# EAGLE design LibreServo-v2 (EAGLE 7.6.0)
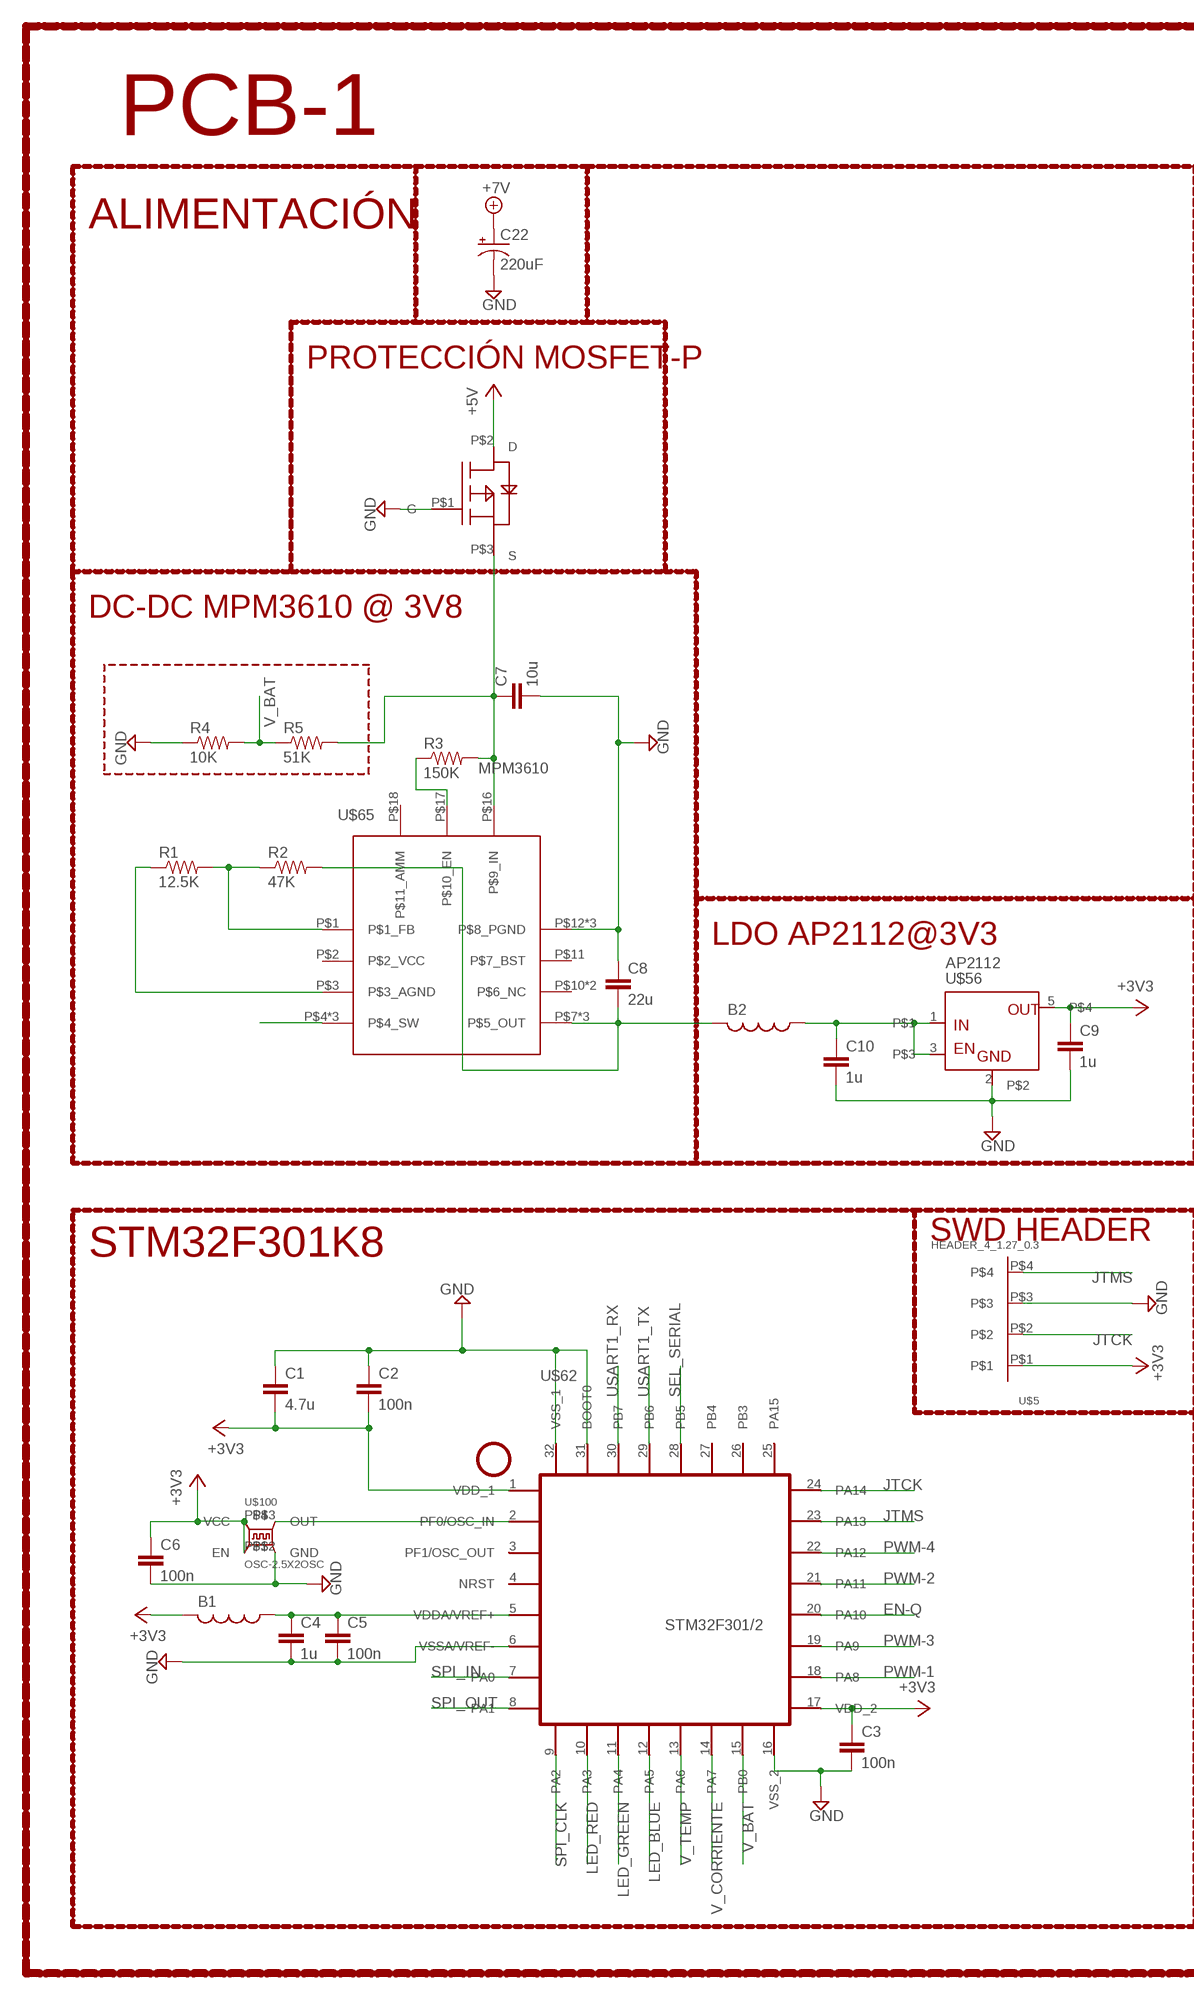
[diagram p0: schematic, sheet 1, part 1 of 2]
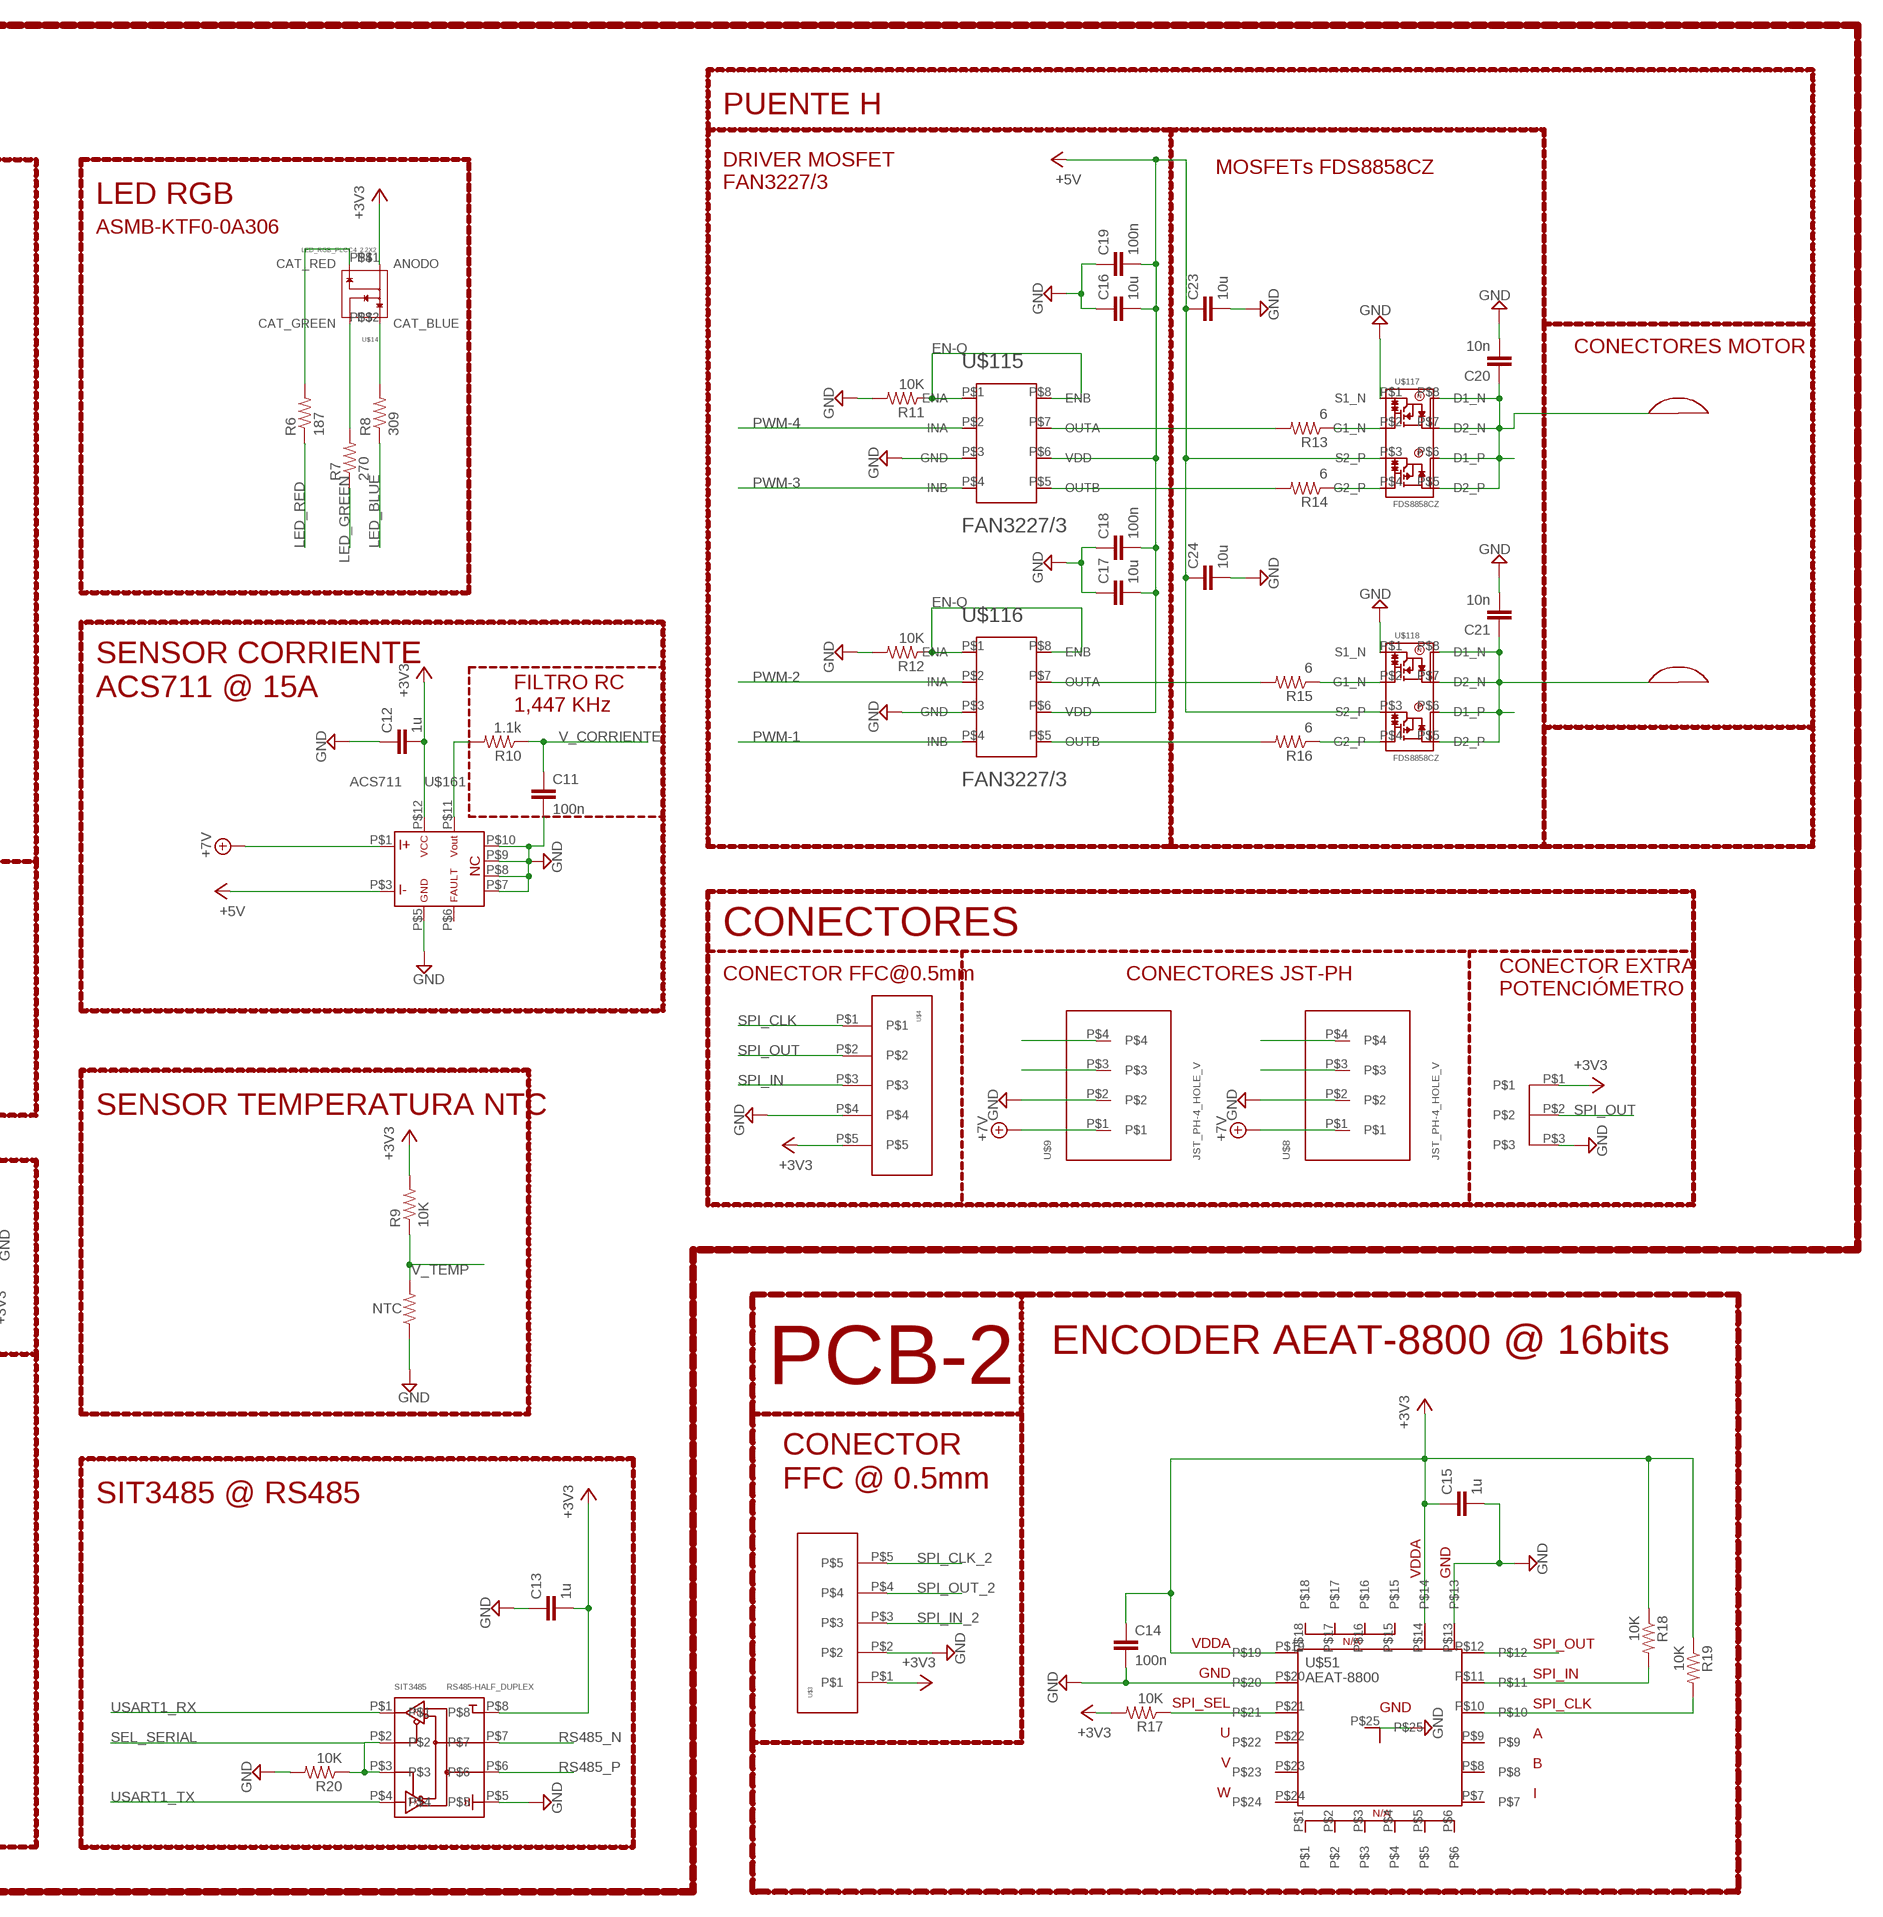
[diagram p1: schematic, sheet 1, part 2 of 2]

## Parts
B1  FERRITE_BEAD_0402  [0402]
B2  FERRITE_BEAD_0603  [0603]
C1  4.7u  C-EU0402  [0402]
C2  100n  C-EU0402  [0402]
C3  100n  C-EU0402  [0402]
C4  1u  C-EU0402  [0402]
C5  100n  C-EU0402  [0402]
C6  100n  C-EU0402  [0402]
C7  10u  C-EU0603  [0603]
C8  22u  C-EU1206  [1206]
C9  1u  C-EU0402  [0402]
C10  1u  C-EU0402  [0402]
C11  100n  C-EU0402  [0402]
C12  1u  C-EU0402  [0402]
C13  1u  C-EU0402  [0402]
C14  100n  C-EU0402  [0402]
C15  1u  C-EU0402  [0402]
C16  10u  C-EU0603  [0603]
C17  10u  C-EU0603  [0603]
C18  100n  C-EU0402  [0402]
C19  100n  C-EU0402  [0402]
C20  10n  C-EU0402  [0402]
C21  10n  C-EU0402  [0402]
C22  220uF  CPOL-USE2.5-6  [E2,5-6]
C23  10u  C-EU0603  [0603]
C24  10u  C-EU0603  [0603]
M1  M1  P5103EMA  [SOT23]
NTC  R-US0402_MIN  [0402_MIN]
R1  12.5K  R-US0402  [0402]
R2  47K  R-US0402  [0402]
R3  150K  R-US0402  [0402]
R4  10K  R-US0402  [0402]
R5  51K  R-US0402  [0402]
R6  187  R-US0402  [0402]
R7  270  R-US0402  [0402]
R8  309  R-US0402  [0402]
R9  10K  R-US0402  [0402]
R10  1.1k  R-US0402  [0402]
R11  10K  R-US0402  [0402]
R12  10K  R-US0402  [0402]
R13  6  R-US0402  [0402]
R14  6  R-US0402  [0402]
R15  6  R-US0402  [0402]
R16  6  R-US0402  [0402]
R17  10K  R-US0402  [0402]
R18  10K  R-US0402  [0402]
R19  10K  R-US0402  [0402]
R20  10K  R-US0402  [0402]
SIT3485  RS485-HALF_DUPLEX  [MSOP-8]
U$1  SLOT  [SERVO_SLOT]
U$2  SLOT  [SERVO_SLOT]
U$3  FFC-5  [FFC-5-0.5]
U$4  FFC-5  [FFC-5-0.5]
U$5  HEADER_4_1.27_0.3  [HEADER_4_1.27_0.3]
U$6  POTEN_SERVO  [POTEN_SERVO]
U$8  JST_PH-4_HOLE_V  [JST_PH-4_HOLEV]
U$9  JST_PH-4_HOLE_V  [JST_PH-4_HOLEV]
U$14  LED_RGB_PLCC4_2.2X2  [PLCC-4_2.2X2]
U$51  AEAT-8800  [QFN24]
U$56  AP2112  [SOT25]
U$62  STM32F301/2  STM32F302  [QFN32]
U$65  MPM3610  MPM36XX  [MPM36XX]
U$100  OSC-2.5X2OSC  [OSC-2.5X2]
U$115  FAN3227/3  [MLP8]
U$116  FAN3227/3  [MLP8]
U$117  FDS8858CZ  [SO-8]
U$118  FDS8858CZ  [SO-8]
U$161  ACS711  [ACS711-QFN]

## Nets
+3V3: B1.2 C1.2 C2.2 C3.1 C6.1 C9.1 C12.2 C13.2 R9.2 SIT3485.P$8 U$4.P$5 U$5.P$1 U$6.P$1 U$14.P$1(ANODO) U$56.5 U$62.1(VDD_1) U$62.17(VDD_2) U$100.P$1(EN) U$100.P$4(VCC) U$161.P$12
+3V3_2: C14.1 C15.1 R17.2 R18.1 R19.1 U$3.P$1 U$51.P$14 U$51.P$19 ; supply symbol labelled +3V3
+5V: C16.2 C17.2 C18.2 C19.2 C23.1 C24.1 M1.P$2(D) U$115.P$6(VDD) U$116.P$6(VDD) U$117.P$3(S2_P) U$118.P$3(S2_P) U$161.P$3
+7V: C22.+ U$8.P$1 U$9.P$1 U$161.P$1
EN-Q: R11.1 R12.1 U$62.20(PA10) U$115.P$1(ENA) U$115.P$8(ENB) U$116.P$1(ENA) U$116.P$8(ENB)
GND: C1.1 C2.1 C3.2 C4.2 C5.2 C6.2 C7.2 C8.1 C9.2 C10.2 C11.2 C12.1 C13.1 C16.1 C17.1 C18.1 C19.1 C20.2 C21.2 C22.- C23.2 C24.2 M1.P$1(G) NTC.1 R4.1 R11.2 R12.2 R20.2 SIT3485.P$5 U$4.P$4 U$5.P$3 U$6.P$3 U$8.P$2 U$9.P$2 U$56.2 U$62.6(VSSA/VREF-) U$62.16(VSS_2) U$62.31(BOOT0) U$62.32(VSS_1) U$65.P$12(P$8_PGND) U$65.P$13(P$8_PGND) U$65.P$14(P$8_PGND) U$100.P$2(GND) U$115.P$3(GND) U$116.P$3(GND) U$117.P$1(S1_N) U$118.P$1(S1_N) U$161.P$5 U$161.P$7 U$161.P$8 U$161.P$9 U$161.P$10
GND_2: C14.2 C15.2 U$3.P$2 U$51.P$13 U$51.P$20 U$51.P$25 ; supply symbol labelled GND
IN_AP2112: B2.1 C10.1 U$56.1 U$56.3
JTCK: U$5.P$2 U$62.24(PA14)
JTMS: U$5.P$4 U$62.23(PA13)
LED_BLUE: R8.1 U$62.12(PA5)
LED_GREEN: R7.1 U$62.11(PA4)
LED_RED: R6.1 U$62.10(PA3)
N$1: R6.2 U$14.P$4(CAT_RED)
N$2: R10.2 U$161.P$11
N$3: U$65.P$4(P$4_SW) U$65.P$5(P$4_SW) U$65.P$6(P$4_SW)
N$4: R7.2 U$14.P$3(CAT_GREEN)
N$5: R8.2 U$14.P$2(CAT_BLUE)
N$8: R13.1 U$117.P$2(G1_N)
N$9: R13.2 U$115.P$7(OUTA)
N$10: R14.2 U$115.P$5(OUTB)
N$11: R14.1 U$117.P$4(G2_P)
N$12: R15.1 U$118.P$2(G1_N)
N$15: R15.2 U$116.P$7(OUTA)
N$17: R17.1 U$51.P$21
N$18: R16.1 U$118.P$4(G2_P)
N$19: R16.2 U$116.P$5(OUTB)
N$23: C7.1 M1.P$3(S) R3.2 R5.2 U$65.P$16(P$9_IN)
N$24: R1.2 R2.1 U$65.P$1(P$1_FB)
N$28: C20.1 U$1.P$1 U$117.P$5(D2_P) U$117.P$6(D1_P) U$117.P$7(D2_N) U$117.P$8(D1_N)
N$32: C21.1 U$2.P$1 U$118.P$5(D2_P) U$118.P$6(D1_P) U$118.P$7(D2_N) U$118.P$8(D1_N)
N$38: R1.1 U$65.P$3(P$3_AGND)
N$42: U$62.2(PF0/OSC_IN) U$100.P$3(OUT)
N$52: B1.1 C4.1 C5.1 U$62.5(VDDA/VREF+)
N$77: R3.1 U$65.P$17(P$10_EN)
OUT_MPM3610: B2.2 C8.2 R2.2 U$65.P$7(P$5_OUT) U$65.P$8(P$5_OUT) U$65.P$9(P$5_OUT)
PWM-1: U$62.18(PA8) U$116.P$4(INB)
PWM-2: U$62.21(PA11) U$116.P$2(INA)
PWM-3: U$62.19(PA9) U$115.P$4(INB)
PWM-4: U$62.22(PA12) U$115.P$2(INA)
RS485_N [Diff]: SIT3485.P$7 U$8.P$3 U$9.P$3
RS485_P [Diff]: SIT3485.P$6 U$8.P$4 U$9.P$4
SEL_SERIAL: R20.1 SIT3485.P$2 SIT3485.P$3 U$62.28(PB5)
SPI_CLK: U$4.P$1 U$62.9(PA2)
SPI_CLK_2: R19.2 U$3.P$5 U$51.P$10
SPI_IN: U$4.P$3 U$62.7(PA0)
SPI_IN_2: R18.2 U$3.P$3 U$51.P$11
SPI_OUT: U$4.P$2 U$6.P$2 U$62.8(PA1)
SPI_OUT_2: U$3.P$4 U$51.P$12
USART1_RX: SIT3485.P$1 U$62.30(PB7)
USART1_TX: SIT3485.P$4 U$62.29(PB6)
V_BAT: R4.2 R5.1 U$62.15(PB0)
V_CORRIENTE: C11.1 R10.1 U$62.14(PA7)
V_TEMP: NTC.2 R9.1 U$62.13(PA6)
Unconnected: U$1.P$2 U$2.P$2 U$51.P$1 U$51.P$2 U$51.P$3 U$51.P$4 U$51.P$5 U$51.P$6 U$51.P$7 U$51.P$8 U$51.P$9 U$51.P$15 U$51.P$16 U$51.P$17 U$51.P$18 U$51.P$22 U$51.P$23 U$51.P$24 U$62.3(PF1/OSC_OUT) U$62.4(NRST) U$62.25(PA15) U$62.26(PB3) U$62.27(PB4) U$65.P$2(P$2_VCC) U$65.P$10(P$6_NC) U$65.P$11(P$7_BST) U$65.P$15(P$6_NC) U$65.P$18(P$11_AMM) U$161.P$6

## Notes on the sheet
- PUENTE H
- PCB-1
- MOSFETs FDS8858CZ
- DRIVER MOSFET
  FAN3227/3
- LED RGB
- ALIMENTACIÓN
- ASMB-KTF0-0A306
- PROTECCIÓN MOSFET-P | CONECTORES MOTOR
- DC-DC MPM3610 @ 3V8
- SENSOR CORRIENTE
  ACS711 @ 15A
- FILTRO RC
  1,447 KHz
- LDO AP2112@3V3
- CONECTORES
- CONECTOR FFC@0.5mm | CONECTORES JST-PH
- CONECTOR EXTRA
  POTENCIÓMETRO
- SENSOR TEMPERATURA NTC
- SWD HEADER
- STM32F301K8
- ENCODER AEAT-8800 @ 16bits
- PCB-2
- CONECTOR
  FFC @ 0.5mm
- SIT3485 @ RS485

## Library data of the parts
B1 = Propio:FERRITE_BEAD_0402
B2 = Propio:FERRITE_BEAD_0603
C1-C21 C23 C24 = Propio:C-EU
C22 = rcl:CPOL-US: POLARIZED CAPACITOR, American symbol
M1 = Propio:P5103EMA
NTC R1-R20 = Propio:R-US
SIT3485 = Propio:RS485-HALF_DUPLEX
U$1 U$2 = Propio:SLOT
U$3 U$4 = Propio:FFC-5
U$5 = Propio:HEADER_4
U$6 = Propio:POTEN_SERVO
U$8 U$9 = Propio:JST_PH-4_HOLE
U$14 = Propio:LED_RGB_PLCC4_2.2X2
U$51 = Propio:AEAT-8800
U$56 = Propio:AP2112
U$62 = Propio:STM32F302
U$65 = Propio:MPM36XX
U$100 = Propio:OSC-2.5X2
U$115 U$116 = Propio:FAN3227/3
U$117 U$118 = Propio:FDS8858CZ
U$161 = Propio:ACS711

## Net classes
1 Diff: width 0.178 mm, clearance 0.152 mm

## Board
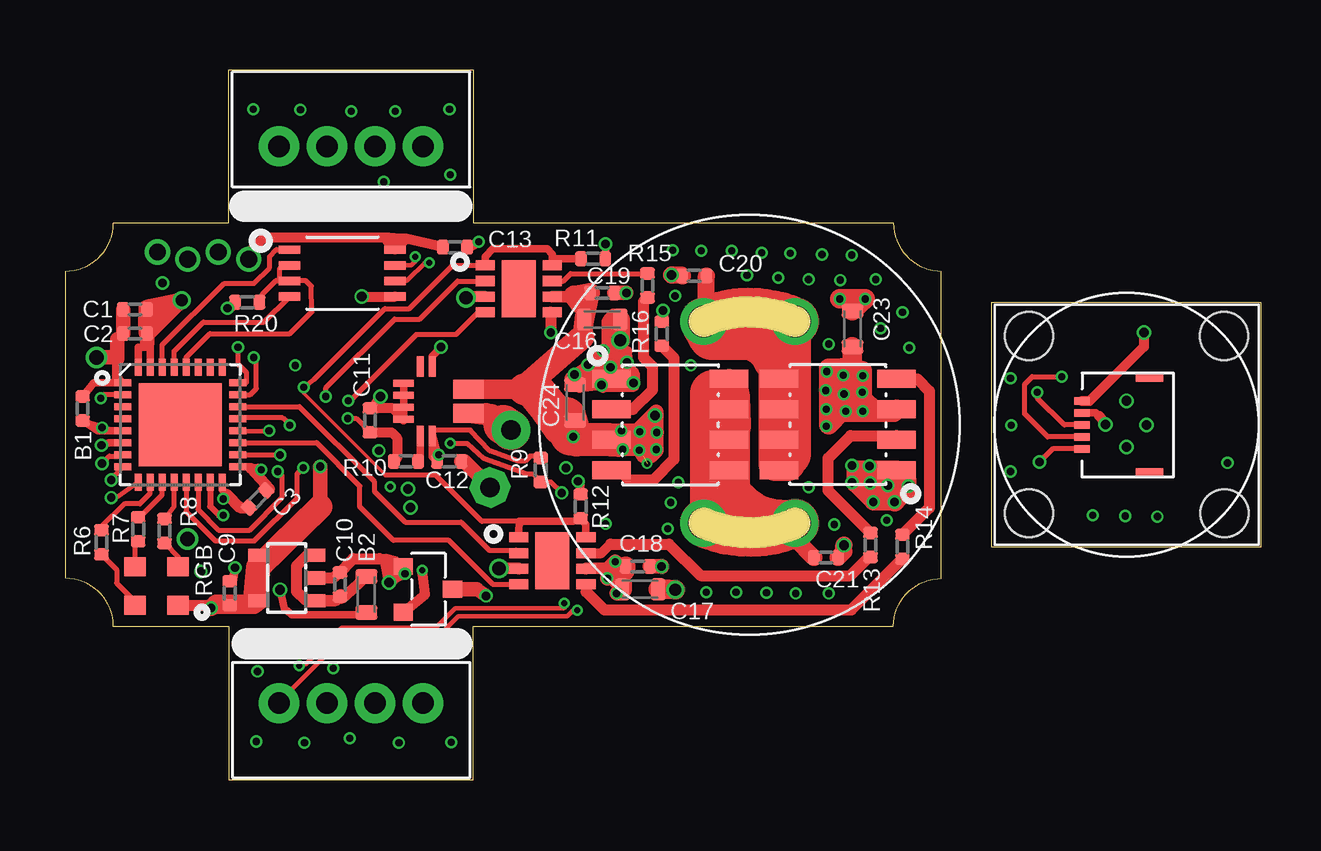
[diagram p2: board, top side]
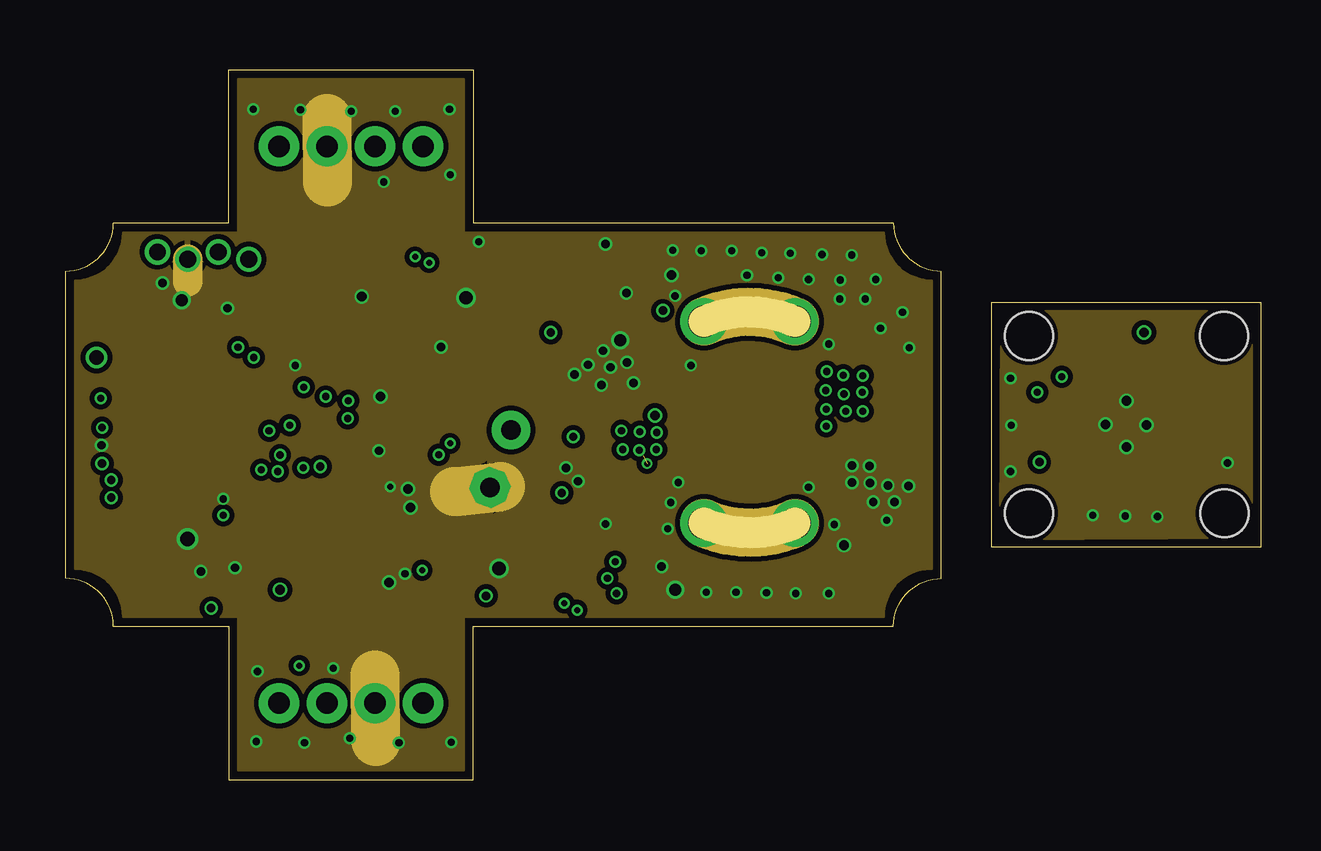
[diagram p3: board, inner layer Route2]
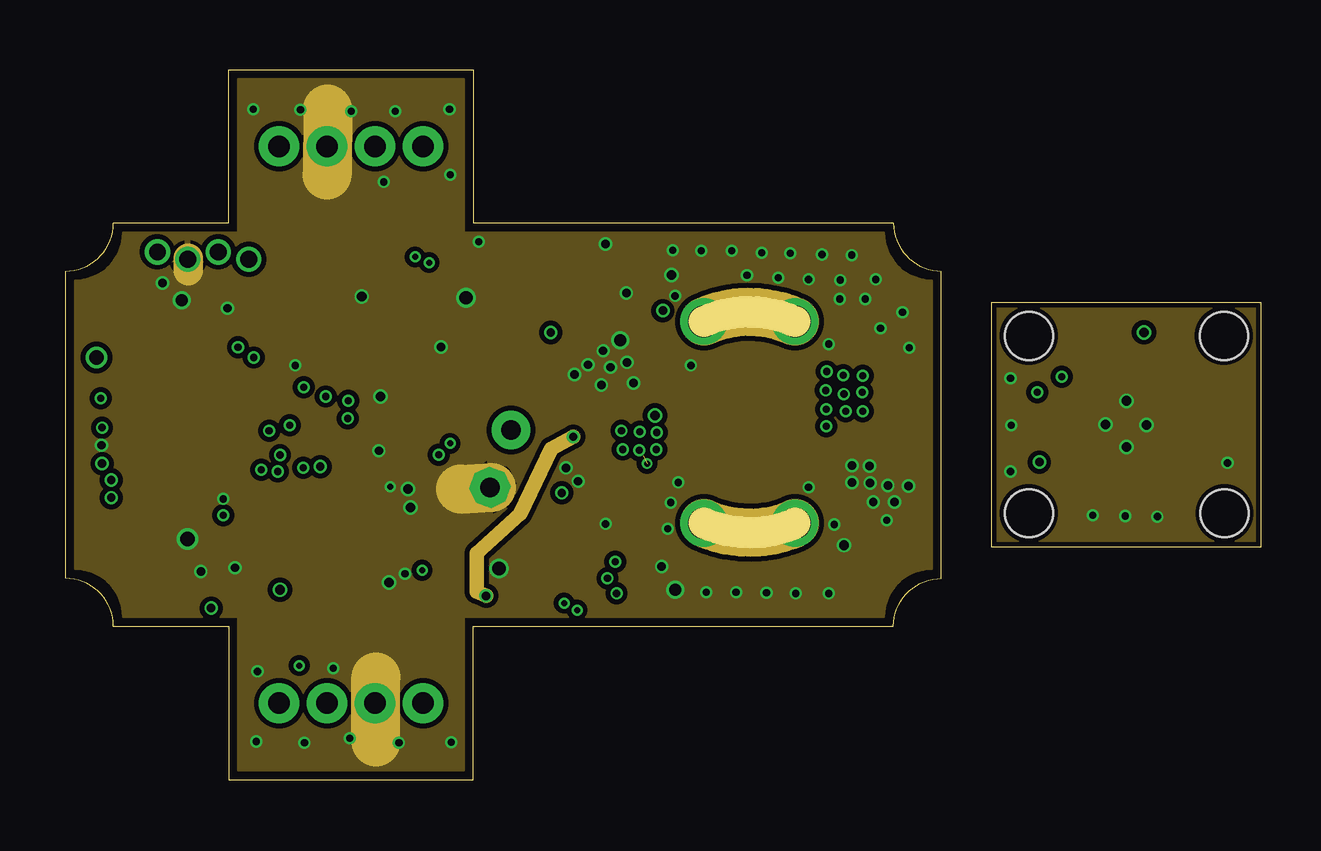
[diagram p4: board, inner layer Route15]
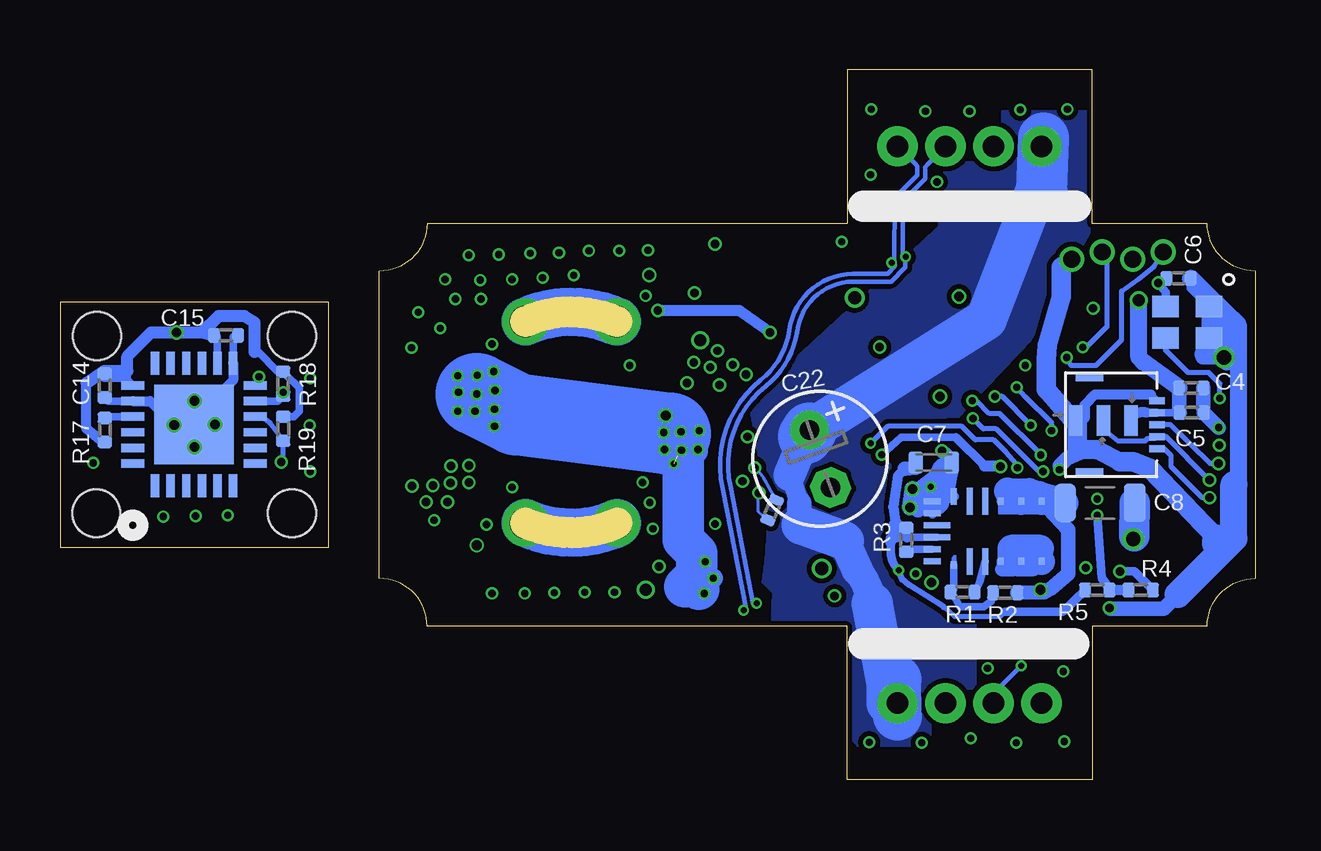
[diagram p5: board, bottom side, seen from below]

Size 49.8 x 29.6 mm. Coordinates in mm from the lower left corner, seen from the top.
Outline: 2,6.4 6.8,6.4 6.8,0 17,0 17,6.4 34.5,6.4 arc-90 36.5,8.4 36.5,21.2 arc-90 34.5,23.2 17,23.2 17,29.6 6.8,29.6 6.8,23.2 2,23.2 arc-90 0,21.2 0,8.4 arc-90 2,6.4
Outline: 38.6,19.9 49.8,19.9 49.8,9.7 38.6,9.7 38.6,19.9
Copper layers (1*2*15*16): Top 0.035559375mm / dielectric 0.17018125mm / Route2 0.01778125mm / dielectric 47mil / Route15 0.01778125mm / dielectric 0.17018125mm / Bottom 0.035559375mm
Design rules "jlcpcb_4_layer *": minimum track width 5mil, minimum drill 0.25mm, track to track 0.126490625mm, track to pad 0.126490625mm, pad to pad 0.126490625mm, via to via 0.126490625mm, smd to smd 0mil, copper to edge 0.1mm, drill to drill 5mil, minimum pad ring 4mil, minimum via ring 4mil, stop-mask expansion 3mil, vias tented up to drill 100mil, thermal gap 10mil
Holes 2 mm at 40.14,11.11 40.14,18.5 48.27,18.5 48.29,11.11

### Footprints (pad centres in the part's own frame; a part is rotated, then mirrored left to right if it is on the bottom)
0402 = smd 0.5 x 0.6: 1 -0.5,0; 2 0.5,0
0603 = smd 0.6 x 0.9: 1 -0.75,0; 2 0.75,0
1206 = smd 0.9 x 1.6: 1 -1.45,0; 2 1.45,0
E2,5-6 = drill 0.813 pad 1.6: + -1.27,0 | drill 0.813 pad 1.6 octagon: - 1.27,0
SOT23 = smd 0.7 x 0.8: P$1 -0.95,-1.25; P$2 0,0.8; P$3 0.95,-1.25
0402_MIN = smd 0.4 x 0.6: 1 -0.45,0; 2 0.45,0
MSOP-8 = smd 0.9 x 0.35: P$1 -2.2,0.975; P$2 -2.2,0.325; P$3 -2.2,-0.325; P$4 -2.2,-0.975; P$5 2.2,-0.975; P$6 2.2,-0.325; P$7 2.2,0.325; P$8 2.2,0.975
SERVO_SLOT = drill 1.3: P$1 -1.9,4.2; P$2 1.9,4.2
FFC-5-0.5 = smd 0.3 x 0.65: P$1 -1,0; P$2 -0.5,0; P$3 0,0; P$4 0.5,0; P$5 1,0 | smd 0.3 x 1.15: P$6 -1.96,2.81; P$7 1.96,2.81
HEADER_4_1.27_0.3 = drill 0.7 pad 1.016: P$1 -2.54,0; P$2 -1.27,0.3; P$3 0,0; P$4 1.27,0.3
POTEN_SERVO = smd 0.55 x 1.27: P$1 -1.15,0; P$2 0,0; P$3 1.15,0
JST_PH-4_HOLEV = drill 0.9 pad 1.676: P$1 -3,0; P$2 -1,0; P$3 1,0; P$4 3,0
PLCC-4_2.2X2 = smd 0.9 x 0.8: P$1 -0.9,0.8; P$2 -0.9,-0.8; P$3 0.9,-0.8; P$4 0.9,0.8
QFN24 = smd 0.95 x 0.35: P$1 -2.55,1.625; P$2 -2.55,0.975; P$3 -2.55,0.325; P$4 -2.55,-0.325; P$5 -2.55,-0.975; P$6 -2.55,-1.625; P$13 2.55,-1.625; P$14 2.55,-0.975; P$15 2.55,-0.325; P$16 2.55,0.325; P$17 2.55,0.975; P$18 2.55,1.625 | smd 0.35 x 0.95: P$7 -1.625,-2.55; P$8 -0.975,-2.55; P$9 -0.325,-2.55; P$10 0.325,-2.55; P$11 0.975,-2.55; P$12 1.625,-2.55; P$19 1.625,2.55; P$20 0.975,2.55; P$21 0.325,2.55; P$22 -0.325,2.55; P$23 -0.975,2.55; P$24 -1.625,2.55 | smd 3.3 x 3.3: P$25 0,0
SOT25 = smd 0.55 x 0.8: 1 -0.95,-1.2; 2 0,-1.2; 3 0.95,-1.2; 4 0.95,1.2; 5 -0.95,1.2
QFN32 = smd 0.3 x 0.7: 1 -1.75,-2.4; 2 -1.25,-2.4; 3 -0.75,-2.4; 4 -0.25,-2.4; 5 0.25,-2.4; 6 0.75,-2.4; 7 1.25,-2.4; 8 1.75,-2.4; 17 1.75,2.4; 18 1.25,2.4; 19 0.75,2.4; 20 0.25,2.4; 21 -0.25,2.4; 22 -0.75,2.4; 23 -1.25,2.4; 24 -1.75,2.4 | smd 0.7 x 0.3: 9 2.4,-1.75; 10 2.4,-1.25; 11 2.4,-0.75; 12 2.4,-0.25; 13 2.4,0.25; 14 2.4,0.75; 15 2.4,1.25; 16 2.4,1.75; 25 -2.4,1.75; 26 -2.4,1.25; 27 -2.4,0.75; 28 -2.4,0.25; 29 -2.4,-0.25; 30 -2.4,-0.75; 31 -2.4,-1.25; 32 -2.4,-1.75 | smd 3.45 x 3.45: EP 0,0
MPM36XX = smd 0.3 x 0.25: P$1 -1.4,1.55; P$4 -1.25,-0.4; P$5 -1.25,-1.25; P$6 -1.25,-2.1; P$7 1.25,-2.1; P$8 1.25,-1.25; P$9 1.25,-0.4 | smd 1.1 x 0.25: P$2 -1.25,0.9; P$3 -1.25,0.25 | smd 1.125 x 0.25: P$10 1.25,0.25; P$11 1.25,0.9 | smd 0.7 x 0.25: P$12 1.45,1.55 | smd 0.25 x 0.7: P$13 1.25,2.45; P$14 0.75,2.45; P$17 -0.75,2.45; P$18 -1.25,2.45 | smd 0.25 x 1.1: P$15 0.25,2.25; P$16 -0.25,2.25
OSC-2.5X2 = smd 0.9 x 1.1: P$1 -0.65,0.9; P$2 -0.65,-0.9; P$3 0.65,-0.9; P$4 0.65,0.9
MLP8 = smd 0.8 x 0.42: P$1 -1.4,0.975; P$2 -1.4,0.325; P$3 -1.4,-0.325; P$4 -1.4,-0.975; P$5 1.4,-0.975; P$6 1.4,-0.325; P$7 1.4,0.325; P$8 1.4,0.975 | smd 1.42 x 2.37: P$9 0,0
SO-8 = smd 1.6 x 0.75: P$1 -2.45,1.905; P$2 -2.45,0.635; P$3 -2.45,-0.635; P$4 -2.45,-1.905; P$5 2.45,-1.905; P$6 2.45,-0.635; P$7 2.45,0.635; P$8 2.45,1.905
ACS711-QFN = smd 1.27 x 0.8: P$1 0,0.5; P$3 0,-0.5 | smd 0.3 x 0.85: P$5 1.5,-1.45; P$6 2,-1.45; P$11 2,1.45; P$12 1.5,1.45 | smd 0.85 x 0.3: P$7 2.7,-0.75; P$8 2.7,-0.25; P$9 2.7,0.25; P$10 2.7,0.75

### Placement (x,y rotation side)
B1  0.71,15.47 90 top
B2  12.54,7.73 270 top
C1  2.9,19.6 180 top
C2  2.9,18.6 180 top
C3  8,11.7 225 top
C4  2.67,16.33 180 bottom
C5  2.64,15.31 180 bottom
C6  3.2,20.9 180 bottom
C7  13.39,13.22 0 bottom
C8  6.47,11.54 180 bottom
C9  6.84,7.77 90 top
C10  11.44,8.14 90 top
C11  12.69,14.98 90 top
C12  15.99,13.27 180 top
C13  16.23,22.2 180 top
C14  47.93,16.44 270 bottom
C15  42.88,18.52 0 bottom
C16  22.37,19.18 180 top
C17  23.94,7.94 180 top
C18  23.84,8.9 180 top
C19  22.36,20.29 180 top
C20  26.2,21 180 top
C21  31.69,9.26 0 top
C22  18.13,13.38 290 bottom
C23  32.79,18.8 90 top
C24  21.23,15.72 90 top
M1  15.32,7.94 270 top
NTC  20.13,11.24 247 bottom
R1  12.19,7.83 180 bottom
R2  10.42,7.8 0 bottom
R3  14.54,10 90 bottom
R4  4.77,7.91 180 bottom
R5  6.59,7.91 180 bottom
R6  1.5,9.9 270 top
R7  3.03,10.45 270 top
R8  4.13,10.37 270 top
R9  19.8,12.91 90 top
R10  14.19,13.27 0 top
R11  21.98,21.72 0 top
R12  21.47,11.4 90 top
R13  33.54,9.79 270 top
R14  34.87,9.71 270 top
R15  24.25,20.6 90 top
R16  24.84,18.59 90 top
R17  47.93,14.58 270 bottom
R18  40.51,16.51 270 bottom
R19  40.5,14.63 270 bottom
R20  7.58,19.9 180 top
SIT3485  11.54,21.12 0 top
U$1  28.5,14.9 0 top
U$2  28.5,14.9 180 top
U$3  42.36,14.79 270 top
U$4  4.1,14.8 90 bottom
U$5  5.1,21.7 0 bottom
U$6  6.32,14.99 0 bottom
U$8  11.9,3.2 180 top
U$9  11.9,26.4 0 top
U$14  3.79,8.08 180 top
U$51  44.21,14.81 90 bottom
U$56  9.22,8.42 90 top
U$62  4.78,14.8 270 top
U$65  11,10.36 90 bottom
U$100  2.83,19.07 270 bottom
U$115  20.29,9.13 0 top
U$116  18.89,20.46 0 top
U$117  32.18,14.8 180 top
U$118  25.2,14.8 0 top
U$161  16.79,15.77 180 top

### Tracks (layer width: path | path; a pad name or v marks a point on that pad's centre or on a via)
+3V3  (via drill 0.3, 0.35, 0.6)
  Top 0.203: R9.2 19.73,13.49 19.36,13.49 19.15,13.28 18.87,13.28 17.68,13.71 16.87,14.58 15.29,14.58 v15.55,13.55
  Top 0.254: U$62.17 8.03,13.05 v8.15,12.93
  Top 0.305: B1.2 1.19,16.55 U$62.1 2.16,16.77 | C12.2 15.29,13.48 | 15.29,13.48 U$161.P$12 | U$62.17 7.68,13.05 7.72,12.98 | 15.29,13.48 15.54,13.48 v15.55,13.55
  Top 0.406: 2.16,16.69 2.16,16.77 2.16,17.55 2.13,17.6 | 2.16,18.36 C2.2 | C13.2 14.2,22.55 SIT3485.P$8 13.31,22.59 14.17,22.55 13.46,22.6 8.28,22.6 7.64,21.96 U$5.P$1
  Top 0.457: 7.72,12.98 8.51,12.12 C3.1 | U$14.P$1 5.95,7.28 arc-90 v6.07,7.16 | U$56.5 7.9,7.54
  Top 0.61: C1.2 C2.2 | 2.16,17.55 2.16,18.36 | v1.29,17.6 2.13,17.6 | 10.62,11.38 v10.62,13.05 | 7.85,7.31 C9.1
  Top 0.66: 6.27,7.31 v6.07,7.16
  Top 0.813: U$56.5 7.85,7.31 6.27,7.31
  Top 1.016: 10.62,11.38 8.03,8.86 7.9,7.54
  Bottom 0.305: C6.1 2.7,20.49 U$100.P$1 | 8.18,12.95 v8.15,12.93 | 10.64,13.08 v10.62,13.05 | v15.55,13.55 14.76,14.27 12.47,14.27 | U$4.P$5 4.35,16.05
  Bottom 0.356: 11.28,13.08 12.47,14.27
  Bottom 0.406: 4.35,16.05 6.68,16.05 7.11,15.62 7.11,15.05 U$6.P$1
  Bottom 0.457: v8.15,12.93 8.15,13.08 | 11.28,13.08 10.64,13.08
  Bottom 0.559: 7.41,14.77 U$6.P$1 | 7.16,13.69 7.41,13.78
  Bottom 0.61: 2.13,17.73 v1.29,17.6 2.18,17.6 | U$100.P$1 U$100.P$4 | v6.07,7.16 6.04,7.14 3.81,7.14 3.23,7.72 | 1.22,17.37 1.17,17.42 | 8.15,13.08 7.82,13.41 7.16,13.69
  Bottom 0.66: 1.71,9.84 1.1,9.84
  Bottom 0.711: 0.89,12.32 0.69,12.52 0.69,18.92 0.71,18.97 | 1.17,17.42 1.32,17.58 1.32,19.56 0.71,18.97 | 0.71,18.97 2.66,20.9 C6.1
  Bottom 0.762: 5.64,13.26 6.58,13.77
  Bottom 0.813: U$100.P$4 2.13,17.73 | 1.69,10.15 4.39,12.98 5.08,13.26 5.64,13.26 | 6.58,13.77 7.41,13.78 7.41,14.77 8.71,16.28 8.71,17.5 8.66,18.11 8.08,20.14 8.08,21.36 U$5.P$1
  Bottom 1.016: 1.71,9.84 1.69,10.15
  Bottom 1.118: 3.23,7.72 1.1,9.84 0.89,10.06 0.89,12.32
+3V3_2  (via drill 0.4)
  Top 0.406: U$3.P$1 42.67,15.79 44.93,18.05 44.94,18.05 v44.94,18.65
  Bottom 0.203: 40.38,16.88 40.38,16.89 R18.1 40.53,17.04 40.74,17.04
  Bottom 0.305: U$51.P$14 43.24,18.48 C15.1 | 40.38,16.88 39.83,16.33 39.83,15.37 40.07,15.13 R19.1 | 47.26,16.94 U$51.P$19 47,16.67 47,17.04 | R17.2 48.02,14.08 | 47.97,17.04 C14.1 | 40.74,17.04 41.53,17.83 41.69,17.83
  Bottom 0.406: 48.02,14.08 48.7,14.63 48.7,16.54
  Bottom 0.508: 48.7,16.54 47.97,17.04 | 47,17.04 47,17.65 46,18.65 v44.94,18.65 43.87,18.65 | 43.87,18.65 C15.1 | 41.69,17.83 41.69,19.05 42.12,19.33 43.19,19.33 43.87,18.65
  Bottom 0.711: C14.1 47.26,16.94
+5V  (via drill 0.25, 0.3, 0.35, 0.4)  (1 unrouted)
  Top 0.457: 31.8,14.81 31.77,14.81 v31.7,14.73 | v31.7,15.44 31.83,15.31 32.31,15.31 32.46,15.31 v32.51,15.37 | 33.5,15.6 33.45,15.6 v33.22,15.37 | 32.51,16.61 32.51,16.89 v32.41,16.87 | v31.73,17.02 31.8,16.94 | 31.8,16.79 31.8,16.36 v31.67,16.23 | v33.22,16.84 33.22,16.87 33.2,16.99
  Top 0.483: U$115.P$6 21.7,8.81 22.61,8.81 22.63,8.79 | U$116.P$6 21.03,20.14 21.03,20.17
  Top 0.508: v23.22,13.77 23.22,13.79
  Top 0.559: 17.13,7.94 v17.53,7.67 | 20.68,14.76 20.76,14.79 | 20.76,14.79 C24.1 | 20.85,15.09 20.76,14.79
  Top 0.61: 22.63,8.79 22.68,8.69 | 21.03,20.17 21.16,20.29 C19.2 | U$118.P$3 22.71,14.55 v23.16,14.55 23.82,14.55 | 23.82,14.55 24.61,15.34 24.61,15.21 | 24.61,15.21 v24.61,13.77 24.61,13.71 24.41,13.51 24.08,13.51 23.93,13.79 23.85,13.79 | 23.01,13.79 23.04,13.77 22.78,13.79 23.01,13.79 | 23.85,13.79 23.22,13.79 23.01,13.79 | 23.85,13.79 24.08,14.02 24.08,14.27 24.21,14.4 | 24.21,14.4 23.82,14.4 23.65,14.22 | 23.82,14.55 23.88,14.55 v23.93,14.5 | 23.85,13.79 v23.9,13.74 | 24.21,14.4 24.56,14.4 v24.64,14.48 | v24.56,15.19 24.59,15.19 24.61,15.21 | v22.96,7.77 23.02,7.77 C17.2 | v22.58,8.41 v22.59,8.41 22.77,8.59 | 22.61,8.81 22.63,8.81 v22.91,9.09 | M1.P$2 17.13,7.94 | v21.16,14.3 21.41,14.48 20.85,15.09
  Top 0.813: C17.2 23.19,8.15 22.77,8.59 22.68,8.69 23.31,8.69 C18.2 | C19.2 21.41,19.84 21.16,20.17 21.84,20.29 C16.2 21.54,18.46 | U$117.P$3 34.51,15.31 32.31,15.31 31.8,14.81 31.8,16.79 31.8,16.94 31.8,17.14 32.79,17.2 | 32.79,17.2 33.2,17.04 33.2,16.99 v33.2,16.15 33.2,15.9 33.5,15.6 32.66,15.6 32.46,15.8 v32.44,16.08 32.46,16.56 32.51,16.61 | U$161.P$3 19.11,16.27 19.09,16.34 | 32.79,17.2 C23.1
  Top 1.016: 19.09,16.34 21.54,18.46 | 21.29,14.16 21.06,14.38
  Top 1.321: 19.11,16.27 19.66,16.1
  Top 1.372: U$118.P$3 21.29,14.16
  Top 1.626: 19.66,16.1 20.22,15.42
  Top 1.651: 20.22,15.42 20.68,14.76
  Top 1.727: 21.06,14.38 20.85,15.09
  Route15 0.61: v17.53,7.67 17.14,7.85 17.14,9.45 18.95,11.09 20.24,13.79 v21.16,14.3
  Bottom 0.305: 23.16,9.37 23.16,9.35 v22.91,9.09
  Bottom 0.813: C17.2 23.05,7.94 v22.58,8.41
  Bottom 1.016: v24.64,14.48 23.34,14.48 23.32,14.5 23.32,13.69 24.54,13.69 24.59,13.74 24.59,15.21 24.64,15.27 24.11,15.27 23.34,14.5 24.51,14.5 24.4,14.43
  Bottom 1.727: C17.2 23.3,8.05 23.77,8.05 23.27,8.56 23.27,9.45 23.82,10.01 23.82,13.66 v23.9,13.74
  Bottom 3.429: 24.4,14.43 30.78,15.24 v32.44,16.08
  other vias: 24.23,13.18
+7V
  Top 0.813: 17.53,15.3 U$161.P$1 17.75,15.15
  Top 1.016: 18.24,14.81 17.75,15.15
  Top 1.651: C22.+ 18.24,14.81
  Bottom 0.813: 19,11.53 19.2,12.19 19.41,12.7
  Bottom 1.016: 18.92,10.62 19,10.54 19,11.53
  Bottom 1.219: 15.95,7.34 arc-28 16.59,8.76
  Bottom 1.321: 16.59,8.76 17.12,9.96 | 19.41,12.7 18.75,14.3
  Bottom 1.626: 17.12,9.96 18.92,10.62
  Bottom 1.727: U$9.P$1 8.71,26.4 8.71,25.65 11.2,19.2 C22.+ | U$8.P$1 15.34,3.2 15.34,3.94 15.95,7.34
  Bottom 2.032: 14.91,2.67 14.94,4.19
  Bottom 2.134: 8.89,24.54 8.81,26.74
  Bottom 2.286: 18.75,14.3 C22.+
  pour Bottom (isolate 0.203): 6.99,27.86 10.54,27.86 10.54,25.73 13.16,25.73 13.16,23.06 21.08,15.79 20.24,11.07 20.4,9.17 20.52,8.23 20.09,7.8 20.12,6.78 20.14,6.53 16.99,6.48 16.94,6.43 16.94,1.8 16.56,1.42 13.94,1.42 13.54,1.83 13.54,3.45 13.18,3.81 11.66,3.81 11.66,6.55 12.9,6.6 15.37,9.17 15.01,12.5 15.39,13.66 15.49,15.01 12.34,15.14 9.42,18.26 6.91,22.81
EN-Q  (via drill 0.3)
  Top 0.152: 13.34,12.7 9.8,16.23 v9.93,16.36
  Top 0.203: U$62.20 7.2,14.53 v8.48,14.55 | v9.93,16.36 10.36,16.69 13.31,19.63 14.33,19.63 16.13,21.44 U$116.P$1 | 18.9,10.77 17.35,10.77 15.42,12.7 13.34,12.7
  Top 0.305: U$115.P$8 21.69,10.65 21.34,10.99 R12.1 21.16,10.77 18.9,10.77 18.89,10.32 U$115.P$1 | U$116.P$1 17.48,21.8 17.8,22.12 20.07,22.12 20.29,21.9 U$116.P$8 arc-90 20.57,21.72 R11.1
  Bottom 0.203: v8.48,14.55 8.48,14.88 9.55,15.95 v9.93,16.36
GND  (via drill 0.25, 0.3, 0.35, 0.4, 0.5, 0.55, 0.6)
  Top 0.203: 6.53,12.09 7.32,11.48 v6.58,11.71
  Top 0.305: U$62.31 3.53,18.11 | 3.53,18.11 3.4,18.19 | U$62.32 3.03,18.03 3.05,18.03 3.45,18.03 3.53,18.11 | 12.94,15.48 C11.2 | U$161.P$10 U$161.P$9 U$161.P$8 U$161.P$7 | U$62.16 6.53,12.09 6.73,11.89 | U$62.6 1.83,14.05 v1.5,13.94 | U$161.P$5 15.29,17.65 v15.65,18.03 | R11.2 22.5,21.74 v22.5,22.33 | M1.P$1 13.46,8.18 v14.15,8.58 | R12.2 21.47,12.35 v21.36,12.45
  Top 0.356: C9.2 7,8.35 v7.06,8.84
  Top 0.406: C13.1 16.92,22.25 v17.22,22.43 | 12.94,15.48 12.94,15.71 v13.13,15.98 | U$161.P$10 13.63,15.48 C11.2 | v6.75,19.65 6.88,19.69 R20.2 | v12.34,20.14 v12.35,20.14 SIT3485.P$5 | 21.03,16.43 21.23,16.43 C24.2
  Top 0.457: U$56.2 11.15,8.42 11.37,8.59 C10.2 11.74,8.98 11.99,9.22 13.09,9.22 13.29,9.19 | 6.73,11.89 7.27,11.35 C3.2 | U$116.P$3 16.79,20.14 v16.69,20.09 | 13.46,8.36 13.79,9.07 13.29,9.19 | 13.29,9.19 v13.49,8.23 | U$118.P$1 22.4,16.36 v22.33,16.46 21.41,16.36 21.03,16.43 21.03,16.74 21.92,16.79 21.06,16.79 21.69,17.22 23.42,17.22 23.7,16.94 23.7,16.43 23.65,16.38 22.55,16.38 21.87,17.07 21.87,17.4 22,17.52 23.42,17.35 23.39,17.65 23.39,17.86 23.27,17.73 22.17,17.73 22.38,17.93 22.73,17.93 22.58,18.08 22.58,19.15 22.63,19.2 22.81,19.41 23.11,18.9 v23.11,18.31
  Top 0.483: U$115.P$3 18.88,8.81 v18.06,8.81
  Top 0.61: 3.4,18.19 C2.1 | C18.1 v24.84,8.9 v24.84,8.89 | C19.1 v23.37,20.29 | C12.1 16.61,13.28 C22.-
  Top 0.66: C2.1 4.81,20.01 v4.85,19.99 3.5,19.71 3.81,19.58 3.38,18.64 3.35,18.92 3.37,19.66 C1.1
  Top 0.711: C20.2 25.67,21.03 v25.25,21.03 | C21.2 32.44,9.51 v32.44,9.78
  Top 0.813: C17.1 25.12,7.94 v25.4,7.92 | C16.1 v23.11,18.31 | U$117.P$1 32.96,12.89 32.94,12.88 32.94,12.37 33.68,11.63 34.59,11.63 | 34.59,11.63 35.05,12.09 35.05,12.5 35,12.55 34.75,12.29 33.68,12.29 | v34.54,11.58 34.59,11.63 | C23.2 v33.33,20.04 v32.26,20.04
  Route2 1.219: 5.09,20.75 U$5.P$3
  Route2 2.032: 10.92,24.92 10.9,27.56 | 12.93,1.6 12.9,4.37 | 16.2,12.01 18.14,12.22
  Route15 1.219: 5.11,21.74 5.11,21.21
  Route15 2.032: 10.92,27.97 10.9,25.2 | 12.93,1.57 12.93,4.29 | 16.46,12.12 17.75,12.19
  Bottom 0.127: NTC.1 20.37,12.39 arc-18 v20.85,13
  Bottom 0.203: 14.07,12.1 13.97,11.81
  Bottom 0.305: 12.93,12.88 12.93,13.64 v13.06,13.71 | C5.2 U$4.P$4
  Bottom 0.356: U$100.P$2 3.73,20.31 v4.04,20.7 4.04,20.77 C6.2 | R4.1 4.24,7.9 5.03,8.69 v5.64,8.69 | U$4.P$4 4.53,15.3
  Bottom 0.406: 13.31,11.61 U$65.P$12 | U$65.P$13 U$65.P$14 | 4.53,15.3 arc-90 U$6.P$3
  Bottom 0.508: C7.2 14.07,12.1
  Bottom 0.559: v13.06,13.71 12.65,13.33
  Bottom 0.61: C4.2 3.17,15.33 C5.2
  Bottom 0.66: 13.97,11.81 v14.28,12.12 | v14.38,11.35 14.28,12.09 14.05,11.28
  Bottom 0.711: C4.2 4.67,17.42 4.85,17.6 v4.85,19.99
  Bottom 0.914: 5.04,10.15 v5.08,10.03
  Bottom 1.118: U$65.P$13 13.31,11.61 13.06,12.17 12.93,12.88
  Bottom 1.27: C8.1 5.04,10.15
  other vias: 33.5,13.08 32.77,13.11 32.77,12.39 33.66,11.58 33.53,12.37 34.26,12.27 35.13,12.24 21.21,16.89 21.77,17.3 22.4,17.88 22.71,17.2 23.39,17.4 23.67,16.53 25.4,20.17 25.3,22.07 26.49,22.05 27.76,22.05 28.4,21.03 29.69,20.93 29.01,21.97 30.2,21.94 30.96,20.85 31.52,21.89 32.28,20.83 32.77,21.87 33.76,20.85 31.8,18.16 34.87,19.48 35.15,18.01 33.96,18.82 26.7,7.82 27.94,7.82 29.21,7.8 30.43,7.77 31.8,7.77 34.21,10.82 25.53,12.39 25.22,11.56 25.1,10.46 30.96,12.19 32.03,10.64 22.5,10.67 9.58,17.27 8,4.52 11.15,4.65 7.95,1.6 9.96,1.55 11.85,1.73 13.89,1.55 16.08,1.57 7.82,27.94 9.79,27.92 11.91,27.86 13.74,27.87 16,27.94 16.03,25.22 13.26,24.92 13.53,12.22 26.06,17.27
  pour Route2 (isolate 0.203): 0.4,20.8 0.4,8.8 arc-90 2.4,6.8 34.1,6.8 arc-90 36,8.8 36.1,8.8 36.1,20.8 arc-90 34.1,22.8 2.4,22.8 arc-90
  pour Route15 (isolate 0.203, rank 2): 0.4,20.8 0.4,8.8 arc-90 2.4,6.8 34.1,6.8 arc-90 36.1,8.8 36.1,20.8 arc-90 34.1,22.8 2.4,22.8 arc-90
  pour Route2 (isolate 0.203): 7.2,22.8 7.2,29.2 16.6,29.2 16.6,22.8
  pour Route15 (isolate 0.203): 7.2,22.8 7.2,29.2 16.6,29.2 16.6,22.8
  pour Route15 (isolate 0.203, rank 2): 7.2,6.8 7.2,0.4 16.6,0.4 16.6,6.8
  pour Route2 (isolate 0.203): 7.2,6.8 7.2,0.4 16.6,0.4 16.6,6.8
GND_2  (via drill 0.3, 0.4)
  Top 0.305: U$3.P$2 42.93,15.29 43.06,15.16
  Top 0.406: 43.06,15.16 43.09,15.16 v43.34,14.81
  Bottom 0.305: U$51.P$13 42.59,18.47 C15.2 | U$51.P$20 47.78,15.79 C14.2
  Bottom 0.406: U$51.P$13 42.59,16.65 43.26,15.98 44.05,15.98 v44.2,15.8 | U$51.P$20 46.05,15.79 v45.04,14.78 | U$51.P$25 44.21,13.83 v44.2,13.87
  other vias: 39.38,16.74 39.4,14.78 39.38,12.85 42.81,11.02 44.15,11 45.5,10.97 48.42,13.21
  pour Route15 (isolate 0.203): 38.72,19.81 38.72,9.8 49.71,9.8 49.71,19.81
  pour Route2 (isolate 0.203): 39,19.53 38.94,10.03 49.43,10.08 49.43,19.56
IN_AP2112
  Top 0.457: U$56.1 10.01,7.49 9.63,7.85 9.63,8.92 10.08,9.37 U$56.3 | C10.1 11.67,7.69 B2.1
  Top 0.508: U$56.1 11.27,7.49 C10.1
  Top 0.61: 11.46,7.66 C10.1
JTCK  (via drill 0.3)
  Top 0.203: U$62.24 7.54,16.55 7.54,16.97 7.19,17.32 v7.19,18.03
  Bottom 0.203: U$5.P$2 6.17,21.9 6.17,18.9 7.04,18.03 v7.19,18.03
JTMS  (via drill 0.3)
  Top 0.203: U$62.23 7.69,16.05 7.95,16.31 7.95,17.5 v7.85,17.6
  Bottom 0.203: U$5.P$4 4.22,21.41 4.88,20.85 5.56,20.37 5.56,18.34 6.63,17.27 7.67,17.27 7.85,17.45 v7.85,17.6
LED_BLUE
  Top 0.203: R8.1 4.53,11.4 U$62.12
LED_GREEN
  Top 0.203: U$62.11 4.03,11.88 3.1,10.95 R7.1
LED_RED
  Top 0.203: U$62.10 3.53,11.94 3.1,11.51 2.46,11.51 1.5,10.54 R6.1
N$1
  Top 0.203: R6.2 2.13,8.77 2.13,8.2 2.89,7.45 U$14.P$4
N$2
  Top 0.305: U$161.P$11 14.79,13.48 R10.2
N$3
  Bottom 0.356: 10.54,8.79 10.57,8.69 U$65.P$4
  Bottom 0.61: U$65.P$5 10.11,9.05 10.11,8.79 10.54,8.79
  Bottom 1.118: U$65.P$6 9.22,9.12 8.94,9.65 10.19,9.65 9.86,9.04 9.32,9.04 9.39,9.11 U$65.P$5
N$4
  Top 0.203: R7.2 2.89,10.01 U$14.P$3
N$5
  Top 0.203: R8.2 4.69,9.28 U$14.P$2
N$8
  Top 0.457: R13.1 31.77,12.05 31.77,13.41 32.72,14.35 34.63,14.35 U$117.P$2
N$9
  Top 0.406: U$115.P$7 22.33,9.45 22.71,9.83
  Top 0.457: 22.71,9.83 25.15,9.83 26.47,8.51 32.69,8.51 33.47,9.29 R13.2
N$10
  Top 0.406: U$115.P$5 21.69,7.83 21.69,7.82
  Top 0.457: 21.69,7.82 21.72,7.82 22.45,7.09 32.75,7.09 R14.2
N$11
  Top 0.457: U$117.P$4 35.49,16.7 36,16.2 36,11.34 R14.1
N$12
  Top 0.457: R15.1 24.08,19.93 24.08,17.6 24.46,17.22 24.46,16.26 23.64,15.44 U$118.P$2
N$15
  Top 0.203: U$116.P$7 20.74,20.79 21.05,21.1 R15.2
N$17
  Bottom 0.305: U$51.P$21 47.87,15.14 R17.1
N$18
  Top 0.203: R16.1 24.92,18.02
  Top 0.457: 24.92,18.02 25.35,17.58 25.35,13.36 24.49,12.5 23.5,12.5 23.1,12.89 U$118.P$4
N$19  (via drill 0.35)
  Top 0.203: U$116.P$5 20.22,19.49 | 24.89,19.13 R16.2
  Top 0.457: 20.22,19.49 v20.22,18.64 | v24.89,19.56 24.89,19.13
  Bottom 0.457: v20.22,18.64 21.49,19.56 v24.89,19.56
N$23  (via drill 0.25)
  Top 0.406: M1.P$3 14.99,7.73 v14.86,8.74
  Bottom 0.203: 10.44,7.01 10.64,6.81 12.52,6.81 12.98,7.21
  Bottom 0.254: 12.98,7.21 14.43,8.13 14.71,8.36 v14.86,8.74
  Bottom 0.305: U$65.P$16 14.5,10.11 14.57,10.11 R3.2
  Bottom 0.356: R5.2 8.01,7.01 10.44,7.01 | 15.19,9.88 15.19,9.42 arc-37 v14.86,8.74
  Bottom 0.406: 14.5,10.11 14.66,10.19 15.16,10.03 15.19,9.88 | 14.6,12.96 14.89,12.67 15.09,11.38 14.99,10.62
  Bottom 0.508: 14.99,10.31 15.16,10.03
  Bottom 0.61: C7.1 14.14,13.01 14.6,12.96 | 14.99,10.62 14.99,10.31
N$24
  Bottom 0.305: U$65.P$1 12.55,7.94 R1.2 12.49,7.56 12.32,7.21 11.3,7.21 10.99,7.45 R2.1
N$28
  Top 0.711: U$1.P$1 26.7,19.2 C20.1
  Top 0.813: U$117.P$8 29.74,12.91 29.74,13.23
  Top 1.422: 29.74,13.23 30.1,13.59 | 30.1,13.59 30.1,13.16 29.59,13.16 29.59,17.58 29.59,19.1 | 30.1,13.59 30.1,14.16 U$117.P$7 U$117.P$6 U$117.P$5
  Top 1.93: 30.1,13.59 30.1,19.1 30.4,19.1 | U$1.P$1 26.93,18.46 28.5,18.46 arc-57 29.59,17.58
N$32
  Top 0.711: C21.1 30.4,10.05 U$2.P$1
  Top 0.813: U$118.P$8 27.53,16.05 arc-90 27.65,15.96 U$118.P$7 | 27.56,15.95 arc-90 27.65,14.64 U$118.P$6 | 27.56,12.22 arc-90 27.65,12.35 U$118.P$5
  Top 1.93: 27.53,16.05 27,16.1 27,11.33 26.98,11.23 27.58,14.76 27.56,15.95 27.56,12.22 27.08,13.94 27.15,13.41 arc90 29.96,10.7 U$2.P$1
N$38
  Bottom 0.305: R1.1 11.52,8.14 11.48,8.26 U$65.P$3
N$42  (via drill 0.3)
  Top 0.203: U$62.2 1.62,16.05 v1.47,15.9
  Bottom 0.203: v1.47,15.9 1.47,16.51 1.93,16.97 2.79,16.97 3.73,17.9 U$100.P$3
N$52  (via drill 0.3)
  Top 0.305: U$62.5 1.34,14.55 B1.1 1.08,14.81 v1.52,14.68
  Bottom 0.61: v1.52,14.68 1.64,14.81 C5.1 2.17,15.52 C4.1
N$77
  Bottom 0.305: U$65.P$17 14.19,9.61 14.37,9.5 R3.1
OUT_MPM3610  (via drill 0.4)
  Top 0.305: B2.2 12.77,6.88 9.42,6.88 9.12,7.16 v8.94,7.92
  Bottom 0.305: v8.94,7.92 8.79,8.05 8.52,7.96
  Bottom 0.356: 10.16,11.94 10.56,11.95 U$65.P$9
  Bottom 0.61: R2.2 8.79,7.83 8.52,7.96 7.8,8.58 7.8,10.43 U$65.P$7
  Bottom 1.016: 10.31,12.04 9.42,12.06 10.16,11.94
  Bottom 1.118: C8.2 9.39,11.98 9.12,11.84 | 9.12,11.84 9.02,11.89 10.16,11.94 | 10.16,11.94 10.31,12.04 | 10.16,11.94 U$65.P$8 | U$65.P$7 9.21,11.75 9.12,11.84
PWM-1  (via drill 0.3)
  Top 0.203: U$116.P$4 17.2,19.49 16.28,18.57 14.63,18.57 11.86,15.8 v11.79,15.8 | U$62.18 8.93,13.55 v8.94,13.54
  Bottom 0.203: v8.94,13.54 8.97,13.59 10.64,15.27 11.07,15.27 11.61,15.8 v11.79,15.8
PWM-2  (via drill 0.3)
  Top 0.203: v9.35,14.78 9.04,15.09 7.22,15.09 U$62.21 | U$116.P$2 16.34,20.79 14.76,19.2 13.72,19.2 10.85,16.33 v10.85,15.98
  Bottom 0.203: v9.35,14.78 10.54,15.98 v10.85,15.98
PWM-3
  Top 0.203: U$62.19 10.46,14.05 12.27,12.24 12.27,11.38 13.66,9.98 15.98,9.98 17.8,8.15 U$115.P$4
PWM-4
  Top 0.203: U$62.22 9.75,15.55 12.88,12.42 12.88,12.01 14.15,10.74 16.48,10.74 17.65,9.57 18.76,9.57 U$115.P$2
RS485_N  (via drill 0.25)
  Top 0.178: SIT3485.P$7 14.4,21.44 14.69,21.73 v14.57,21.79 | v9.74,4.76 9.75,4.83 10,4.83 11.51,6.34 15.43,6.34 16.24,7.15 20.76,7.15 20.91,7.29 v20.78,7.36
  Bottom 0.178: v14.57,21.79 14.69,21.73 14.69,21.8 | 14.69,21.8 14.69,24.11 13.75,25.05 13.75,25.53 13.67,25.63 U$9.P$3 | U$8.P$3 10.9,3.6 v9.74,4.76 | v20.78,7.36 20.91,7.29 21.86,12.2 arc64 20.39,16.41 arc-43 19.09,18.7 arc81 16.76,20.76 15.17,20.76 14.58,21.35 v14.57,21.79 | 14.69,21.8 arc90 v14.57,21.79
RS485_P  (via drill 0.25)
  Top 0.178: SIT3485.P$6 14.22,20.79 15.04,21.58 v15.15,21.55 | U$8.P$4 8.9,3.26 11.65,6.01 15.56,6.01 16.38,6.82 20.91,6.82 21.22,7.13 v21.32,7.08
  Bottom 0.178: v15.15,21.55 15.05,21.6 15.02,24.25 14.08,25.19 14.08,25.58 14.13,25.63 U$9.P$4 | v21.32,7.08 21.21,7.11 22.18,12.13 arc64 20.6,16.66 arc-43 19.42,18.74 arc81 16.77,21.09 15.31,21.09 15.03,21.4 15.03,21.55 v15.15,21.55 | 15.02,21.55 arc-90 v15.15,21.55
SEL_SERIAL
  Top 0.203: U$62.28 5.03,17.6 6.02,18.59 9.35,18.59 10.26,19.51 10.25,20.57 10.02,20.79 9.37,20.79 SIT3485.P$3 | SIT3485.P$3 9.4,20.79 | R20.1 8.24,20.28 8.76,20.8 8.91,20.8 | 8.91,20.8 9.32,20.8 SIT3485.P$3 | SIT3485.P$2 9.07,21.44 8.91,21.28 8.91,20.8
SPI_CLK  (via drill 0.35)
  Top 0.203: U$62.9 2.11,11.76 v1.91,11.76
  Bottom 0.203: U$4.P$1 3.79,13.8 3.5,13.51 3.5,13.05 2.21,11.76 v1.91,11.76
SPI_CLK_2  (via drill 0.35)
  Top 0.203: U$3.P$5 41.13,13.79 v40.58,13.25
  Bottom 0.203: U$51.P$10 arc55 41.03,14.83 R19.2 40.5,13.33 v40.58,13.25
SPI_IN  (via drill 0.35)
  Top 0.203: v1.52,13.18 1.83,13.49 2.32,13.49 arc90 U$62.7
  Bottom 0.203: v1.52,13.18 1.88,13.18 3.55,14.8 U$4.P$3
SPI_IN_2  (via drill 0.3)
  Top 0.203: U$3.P$3 41.62,14.79 40.49,15.91 v40.49,16.15
  Bottom 0.203: R18.2 40.49,16.01 v40.49,16.15
  Bottom 0.305: U$51.P$11 40.73,15.79 R18.2
SPI_OUT  (via drill 0.35)
  Top 0.203: U$62.8 1.91,12.55 v1.91,12.5
  Bottom 0.203: v1.91,12.5 3.71,14.3 U$4.P$2 4.18,14.22 4.5,14.22 4.6,14.12 5.71,14.12 6.22,14.53 6.22,15.11 U$6.P$2
SPI_OUT_2  (via drill 0.3)
  Top 0.203: U$3.P$4 40.92,14.29 39.96,15.25 39.96,16.48 40.28,16.8 v41.51,16.8
  Bottom 0.305: U$51.P$12 41.51,16.59 v41.51,16.8
USART1_RX
  Top 0.203: U$62.30 4.03,18.13 6.62,20.69 7.85,20.69 8.51,21.35 8.51,21.8 8.79,22.1 SIT3485.P$1
USART1_TX
  Top 0.203: U$62.29 4.53,17.86 5.74,19.08 8.27,19.08 SIT3485.P$4
V_BAT  (via drill 0.3)
  Top 0.254: U$62.15 6.03,11.39 6.4,11.02 v6.58,11.02
  Bottom 0.356: R5.1 6.06,7.94 6.4,8.43 v6.58,11.02
  Bottom 0.406: R4.2 R5.1
V_CORRIENTE  (via drill 0.3)
  Top 0.203: U$62.14 5.53,11.26 6.38,10.41 7.67,10.41 9.02,11.76 9.02,12.67 v8.84,12.85 | 12.41,14.78 C11.1 12.11,15.06 v11.76,15.06
  Top 0.406: C11.1 13.59,14.48 13.82,14.25 13.82,13.4 R10.1
  Bottom 0.203: v8.84,12.85 9.02,12.85 10.79,14.63 11.33,14.63 v11.76,15.06
V_TEMP  (via drill 0.25, 0.3, 0.35)
  Top 0.203: U$62.13 5.03,11.17 6.25,9.96 7.87,9.96 9.65,11.73 9.65,12.75 v9.91,13 | v20.68,11.96 20.23,12.41 R9.1 19.46,12.75 19.23,12.75 17.42,13.41 16.74,14.02 v16.03,14.02
  Bottom 0.127: NTC.2 20.7,11.18 20.7,11.96 v20.68,11.96
  Bottom 0.203: v9.91,13 9.93,13.16 10.39,13.66 10.9,14.17 11.66,14.17 12.22,14.73 15.32,14.73 v16.03,14.02

### Text on the board
tNames: RGB
tDocu: +5V | GND | B | A | JST PH-4 | JTMS | GND | JTCK | 3V3 | <-8.15mm-> | FFC-0.5 | 2mm-> | <-7.4mm-> | JST PH-4 | A | B | GND | +5V
bDocu: GND | B | A | +5V | JST PH-4 | 8MHz | FFC-0.5 | GND | 3V3 | POT | JST PH-4 | A | B | GND | JLCJLCJLCJLC | +5V